# Altium schematic sheet 3_Charging modules.schdoc
size 497 x 243 mm; Name: A_A4; Symbol: A_A4; Device: A_A4; @Project Name: TUD-EnergyHarvestingConsole_2022-08-29_17-01-09; REV: 1.0; Date: 2022-07-06; Sheet: 1/1; Draw By: Alejandro Cabrerizo; Convert to PCB: yes; Add into BOM: yes
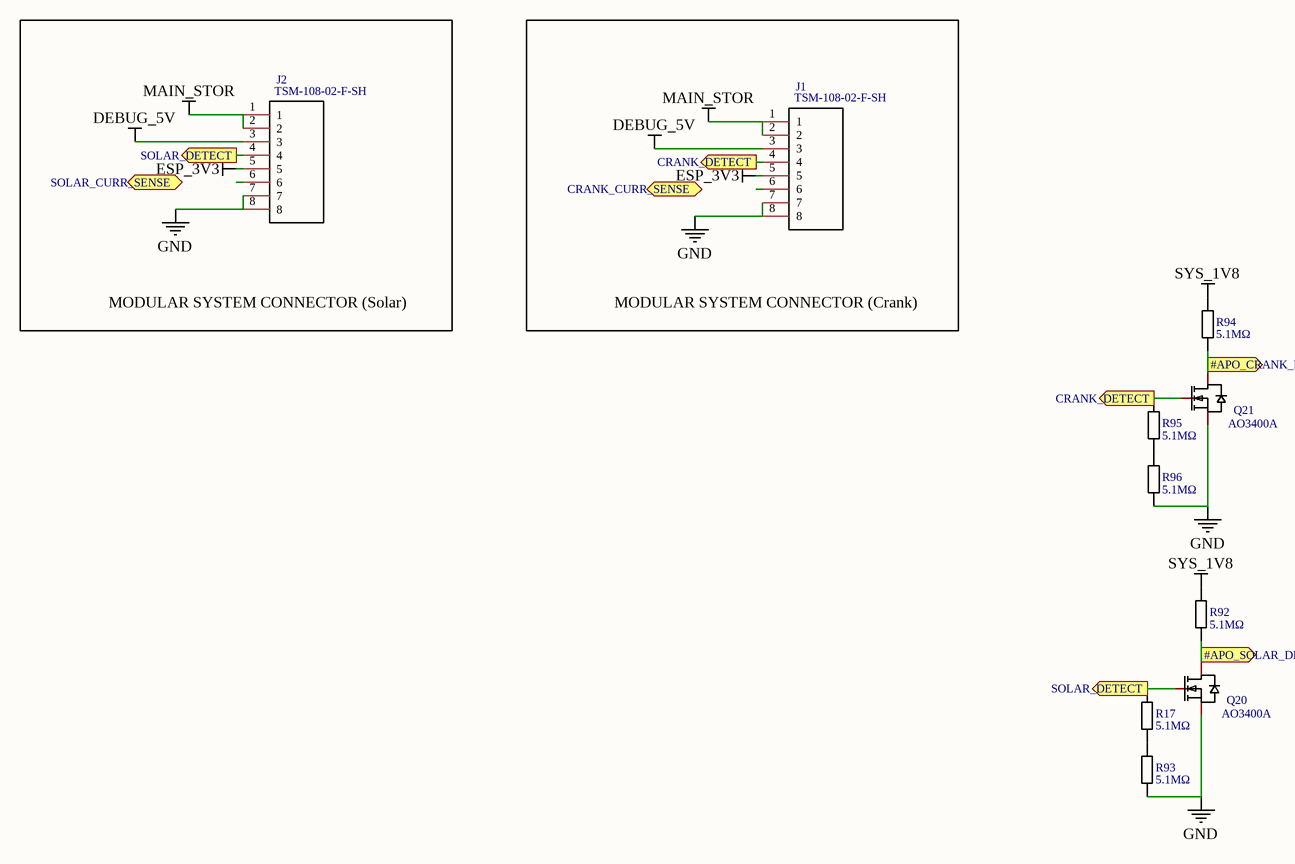
[diagram p0: 3_Charging modules.schdoc]

## Parts
J1  TSM-108-02-F-SH  [TSM-108-YY-ZZZ-SH]
J2  TSM-108-02-F-SH  [TSM-108-YY-ZZZ-SH]
Q20  AO3400A  [SOT-23-3_L2.9-W1.3-P1.90-LS2.4-BR]
Q21  AO3400A  [SOT-23-3_L2.9-W1.3-P1.90-LS2.4-BR]
R17  5.1MΩ  [R0603]
R92  5.1MΩ  [R0603]
R93  5.1MΩ  [R0603]
R94  5.1MΩ  [R0603]
R95  5.1MΩ  [R0603]
R96  5.1MΩ  [R0603]

## Blocks framed on the sheet
MODULAR SYSTEM CONNECTOR (Solar): J2
MODULAR SYSTEM CONNECTOR (Crank): J1

## Ports
#APO_CRANK_DETECT (out), #APO_SOLAR_DETECT (out), CRANK_CURR_SENSE (bidir), CRANK_DETECT (out), SOLAR_CURR_SENSE (bidir), SOLAR_DETECT (out)

## Nets
DEBUG_5V: J1.3 J2.3
ESP_3V3: J1.5 J2.5
GND: J1.7 J1.8 J2.7 J2.8 Q20.2(S) Q21.2(S) R93.2 R96.2
MAIN_STOR: J1.1 J1.2 J2.1 J2.2
SYS_1V8: R92.1 R94.1
#APO_CRANK_DETECT: Q21.3(D) R94.2 ; port #APO_CRANK_DETECT
#APO_SOLAR_DETECT: Q20.3(D) R92.2 ; port #APO_SOLAR_DETECT
CRANK_DETECT: J1.4 Q21.1(G) R95.1 ; port CRANK_DETECT
SOLAR_DETECT: J2.4 Q20.1(G) R17.1 ; port SOLAR_DETECT
NetR17_2: R17.2 R93.1
NetR95_2: R95.2 R96.1

Not connected (* = marked no-connect by the designer): J1 6; J2 6

## Notes on the sheet
- 1
- 2
- 3
- 4
- 5
- A
- B
- C
- D
- TITLE:
- TUD-EnergyHarvestingConsole_2022-08-29_17-01-09
- REV:
- 1.0
- Date:
- Company:
- 2022-07-06
- Drawn By:
- Alejandro Cabrerizo
- Sheet:
- 1/1

## Library data of the parts
J1 J2 = TSM-108-02-F-SH: Convert to PCB: yes; Name: TSM-108-02-F-SH; Symbol: TSM-108-02-F-SH; Device: TSM-108-02-F-SH; Add into BOM: yes; Origin Footprint: TSM-108-YY-ZZZ-SH
Q20 = AO3400A: Manufacturer: HUASHUO(华朔); Convert to PCB: yes; Name: AO3400A; Symbol: AO3400A; Device: AO3400A; Supplier: LCSC; Supplier Part: C700953; Manufacturer Part: AO3400A; JLCPCB Part Class: Extended Part; Add into BOM: yes; Origin Footprint: SOT-23-3_L2.9-W1.3-P1.90-LS2.4-BR
Q21 = AO3400A: Manufacturer: HUASHUO(华朔); Convert to PCB: yes; NAME: D; NUMBER: 3; Name: AO3400A; Symbol: AO3400A; Device: AO3400A; Supplier: LCSC; Supplier Part: C700953; Manufacturer Part: AO3400A; JLCPCB Part Class: Extended Part; Add into BOM: yes; Origin Footprint: SOT-23-3_L2.9-W1.3-P1.90-LS2.4-BR
R17 R92-R96 = 0603WAF5104T5E: Manufacturer: UniOhm; Resistance: 5.1M; Convert to PCB: yes; NAME: 1; Name: 5.1MΩ; Symbol: 5.1MΩ; Device: 0603WAF5104T5E; Supplier: LCSC; Manufacturer Part: 0603WAF5104T5E; Supplier Part: C13320; JLCPCB Part Class: Basic Part; Add into BOM: yes; Origin Footprint: R0603; NUMBER: 1